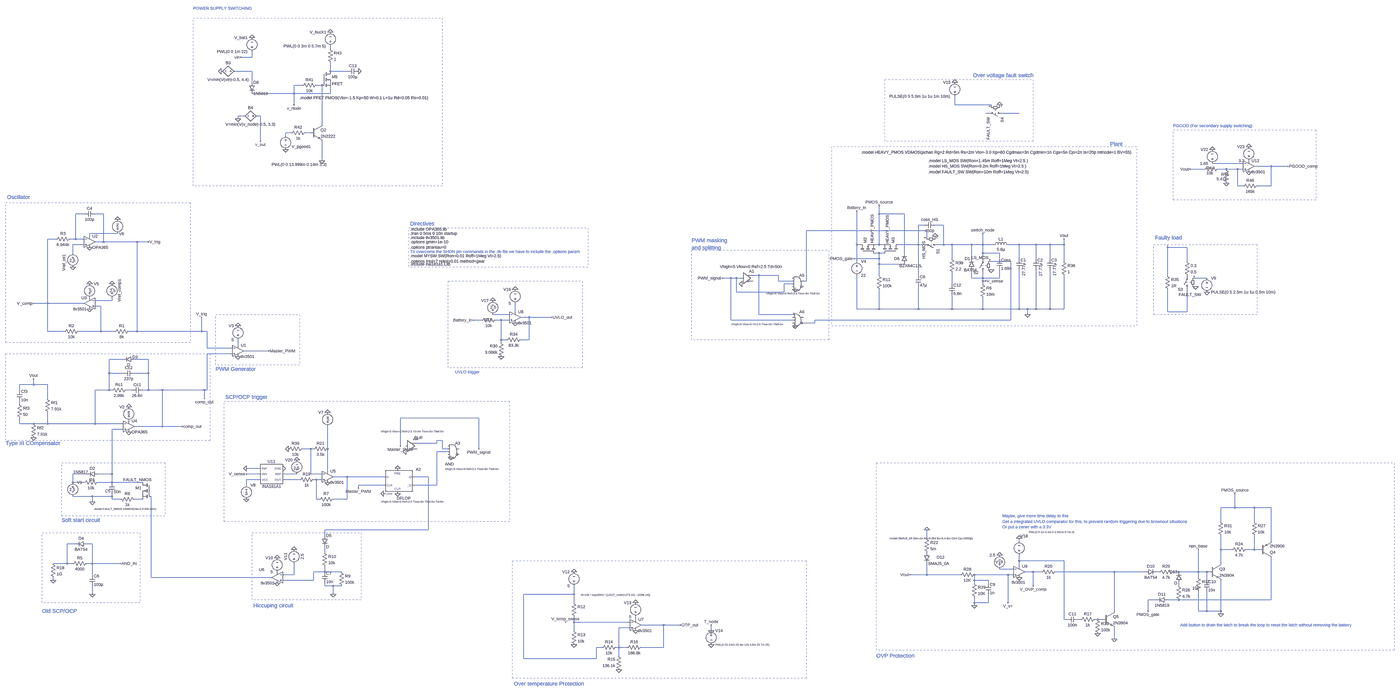
[diagram p0: schematic behavioural_model_complete.asc, whole sheet]
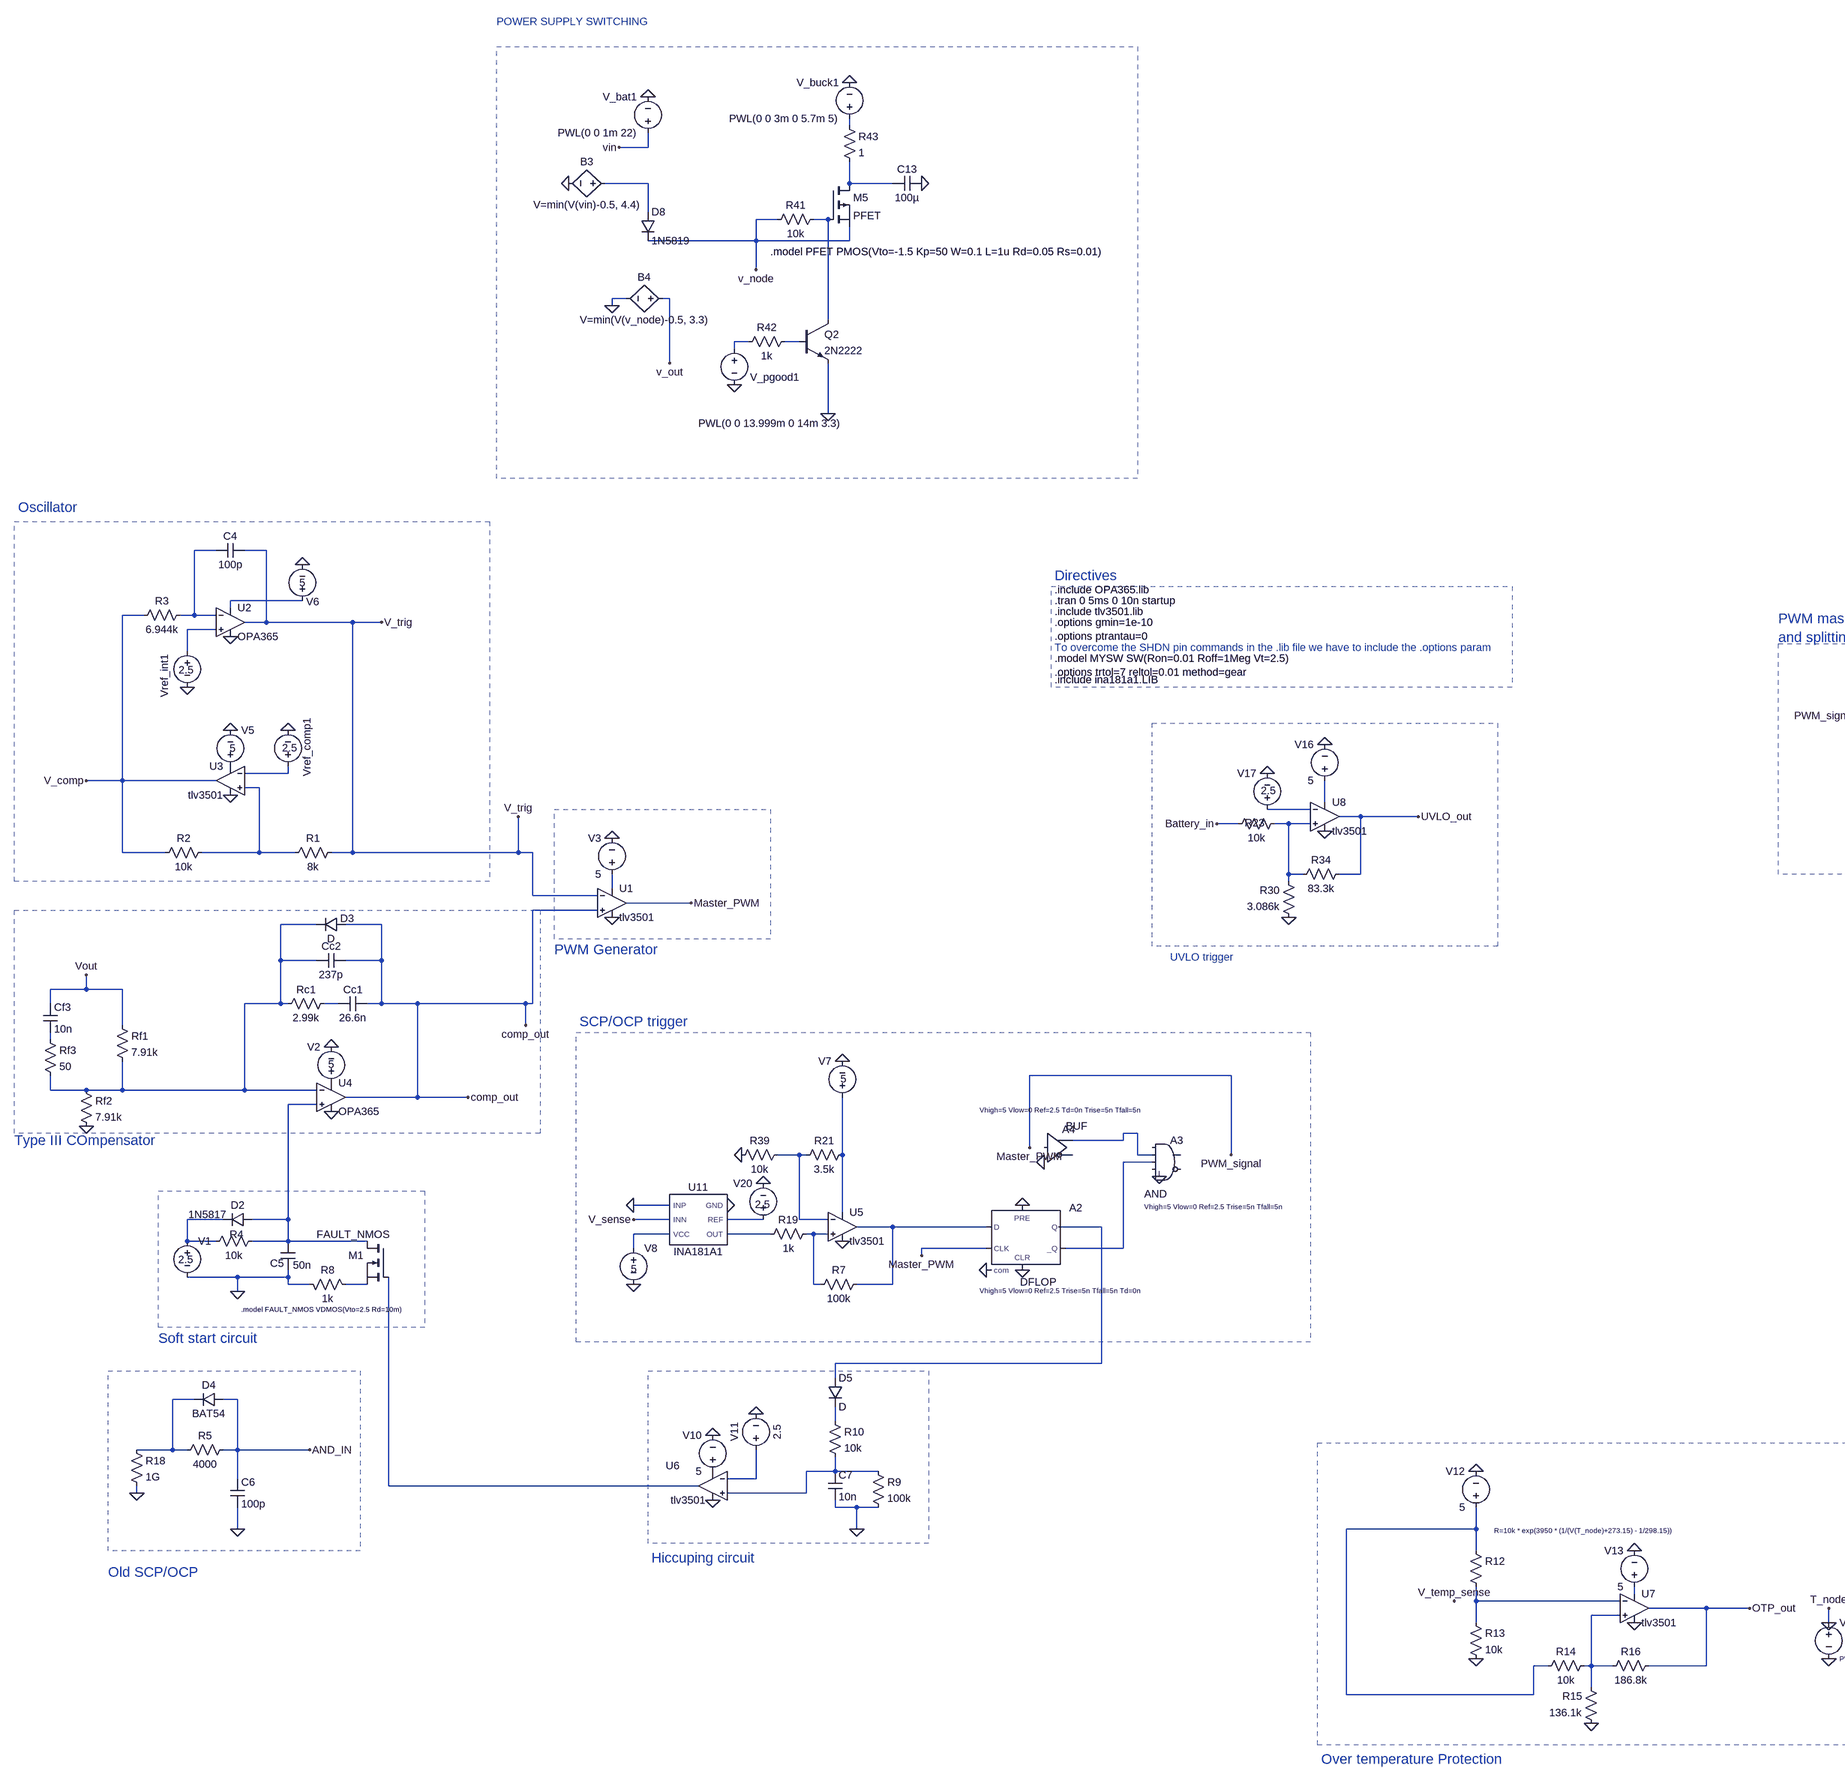
[diagram p1: schematic behavioural_model_complete.asc, part, row 1 of 1, column 1 of 2]
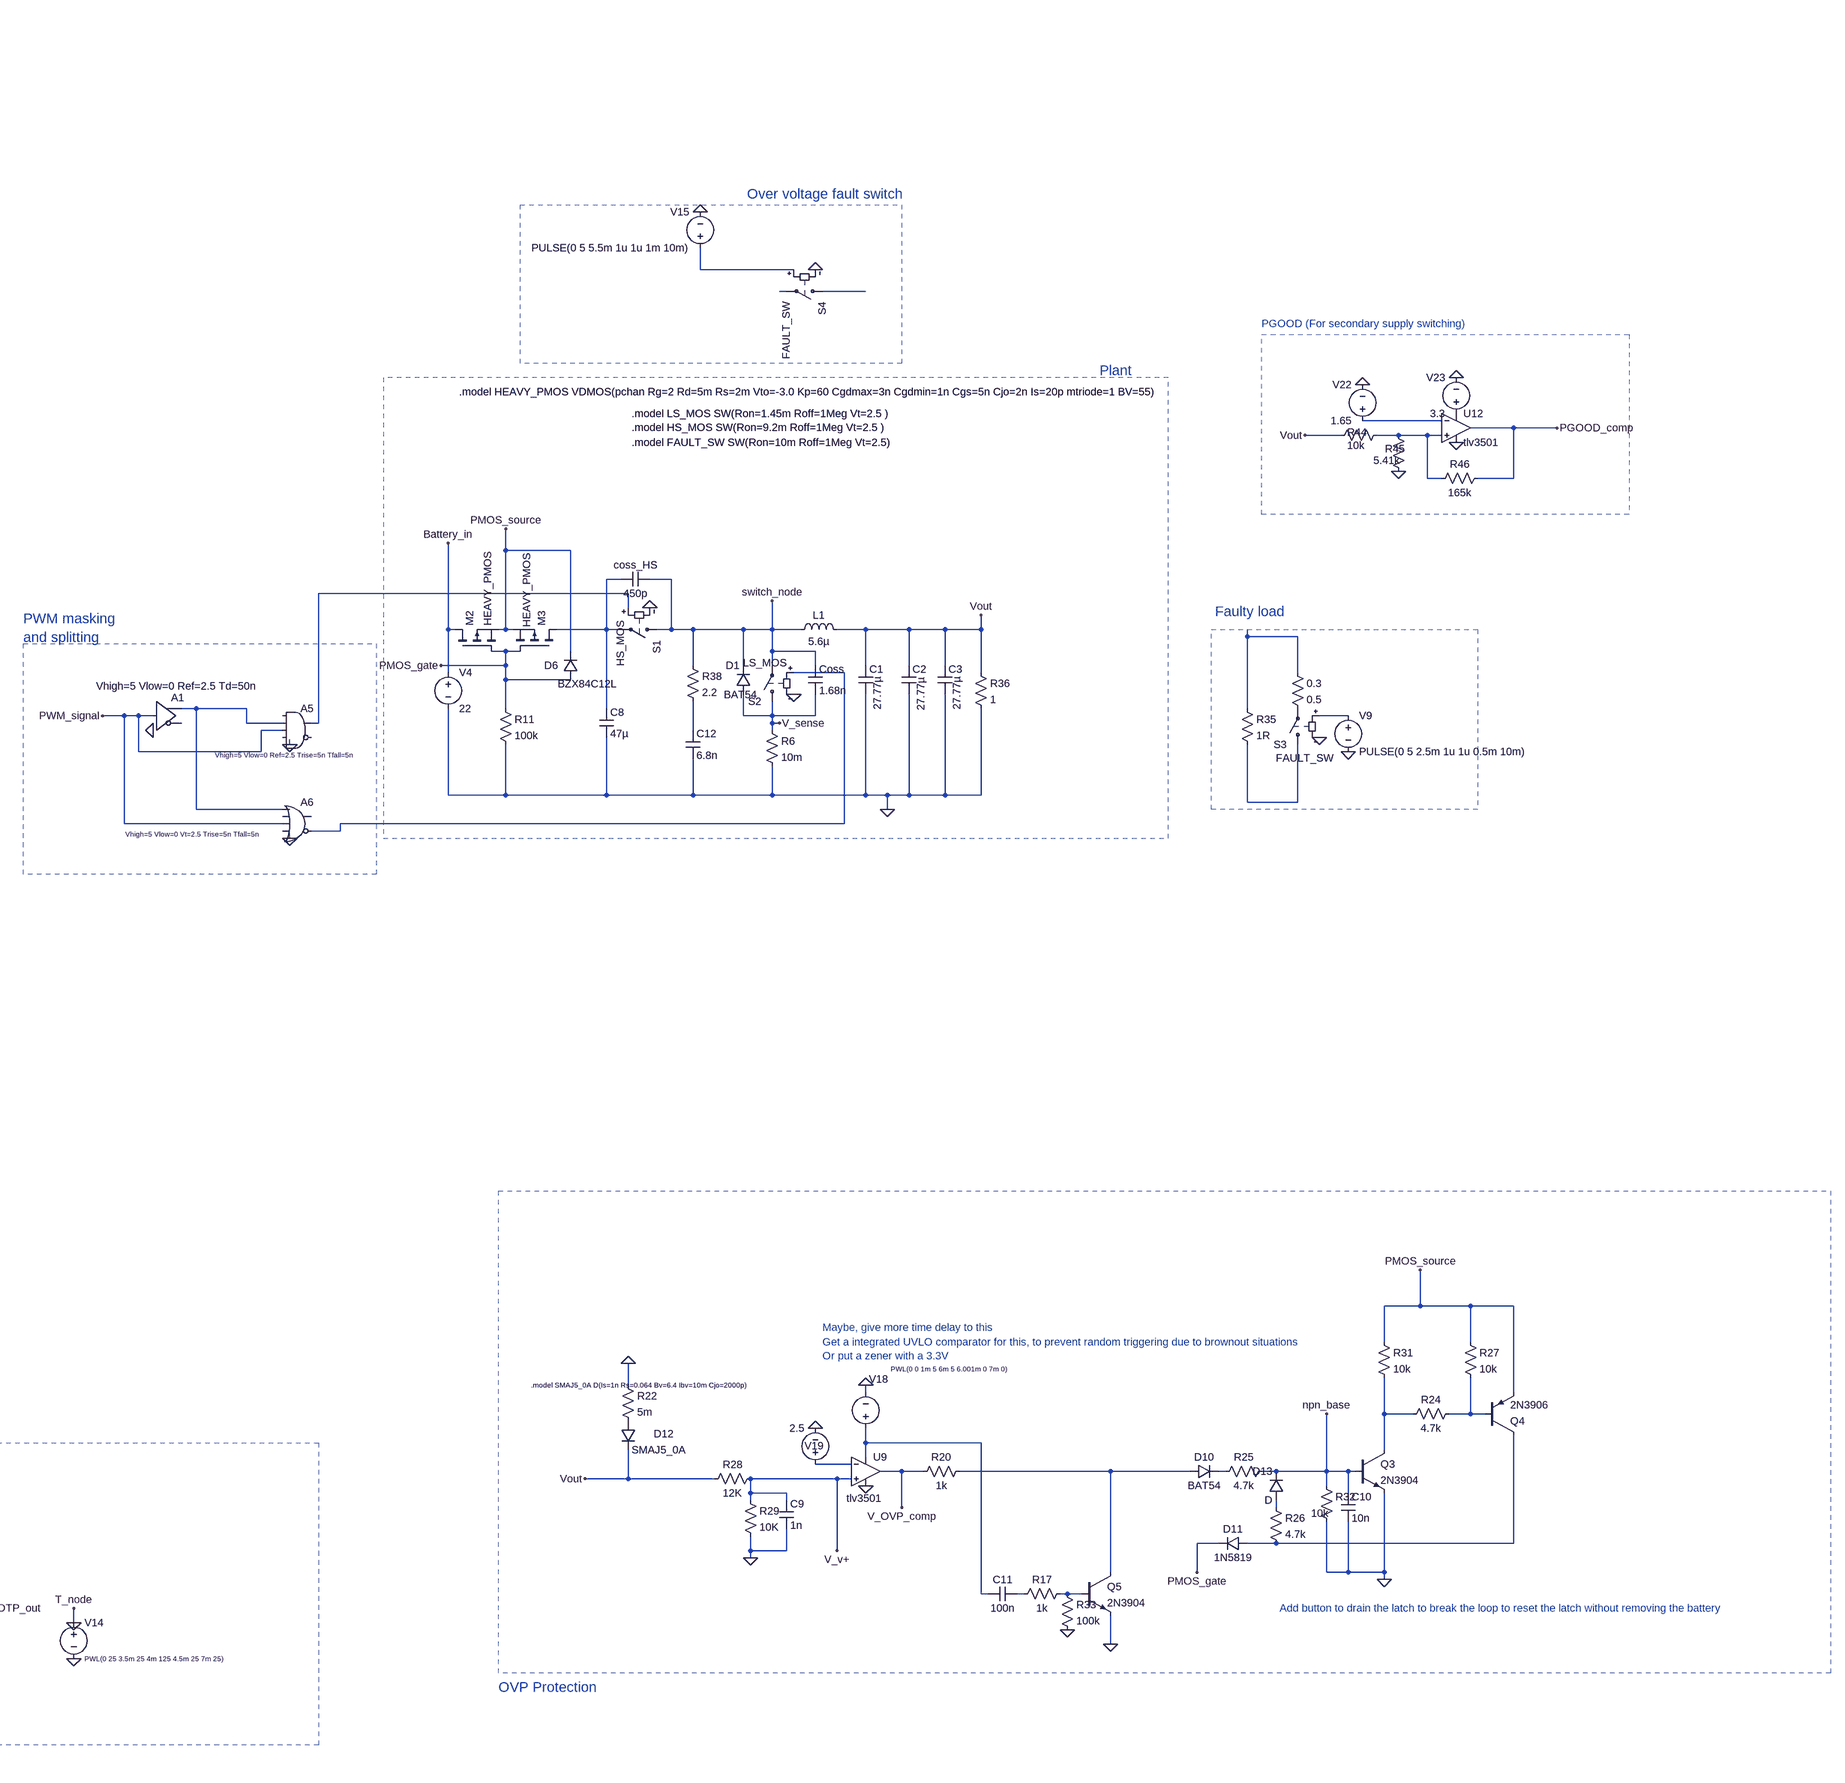
[diagram p2: schematic behavioural_model_complete.asc, part, row 1 of 1, column 2 of 2]
behavioural_model_complete.asc, the LTspice schematic file:
Version 4.1
SHEET 1 6772 2808
WIRE 688 -1504 688 -1520
WIRE 240 -1456 240 -1488
WIRE 240 -1456 176 -1456
WIRE 240 -1376 144 -1376
WIRE 688 -1376 688 -1424
WIRE 784 -1376 688 -1376
WIRE 240 -1312 240 -1376
WIRE 528 -1296 480 -1296
WIRE 640 -1296 608 -1296
WIRE 480 -1248 480 -1296
WIRE 480 -1248 240 -1248
WIRE 688 -1248 688 -1280
WIRE 688 -1248 480 -1248
WIRE 480 -1184 480 -1248
WIRE 4256 -1184 4256 -1232
WIRE 4464 -1184 4256 -1184
WIRE 4448 -1136 4432 -1136
WIRE 4624 -1136 4528 -1136
WIRE 192 -1120 160 -1120
WIRE 288 -1120 272 -1120
WIRE 160 -1104 160 -1120
WIRE 640 -1072 640 -1296
WIRE 464 -1024 432 -1024
WIRE 576 -1024 544 -1024
WIRE 432 -1008 432 -1024
WIRE 288 -976 288 -1120
WIRE 640 -864 640 -976
WIRE 5904 -848 5728 -848
WIRE 6064 -832 5968 -832
WIRE 6160 -832 6064 -832
WIRE 5680 -816 5600 -816
WIRE 5808 -816 5760 -816
WIRE 5872 -816 5808 -816
WIRE 5904 -816 5872 -816
WIRE 5872 -720 5872 -816
WIRE 5904 -720 5872 -720
WIRE 6064 -720 6064 -832
WIRE 6064 -720 5984 -720
WIRE -720 -560 -768 -560
WIRE -608 -560 -656 -560
WIRE 3824 -560 3824 -608
WIRE 3968 -560 3824 -560
WIRE 4080 -496 4048 -496
WIRE 4192 -496 4144 -496
WIRE 4096 -464 3408 -464
WIRE -528 -448 -688 -448
WIRE -688 -432 -688 -448
WIRE 4096 -432 4096 -464
WIRE -880 -416 -928 -416
WIRE -768 -416 -768 -560
WIRE -768 -416 -800 -416
WIRE -720 -416 -768 -416
WIRE -608 -400 -608 -560
WIRE -608 -400 -656 -400
WIRE -416 -400 -608 -400
WIRE -352 -400 -416 -400
WIRE -720 -384 -784 -384
WIRE 3696 -384 3696 -576
WIRE 3712 -384 3696 -384
WIRE 3824 -384 3824 -560
WIRE 3824 -384 3808 -384
WIRE 3840 -384 3824 -384
WIRE 4048 -384 4048 -496
WIRE 4048 -384 3936 -384
WIRE 4080 -384 4048 -384
WIRE 4192 -384 4192 -496
WIRE 4192 -384 4160 -384
WIRE 4240 -384 4192 -384
WIRE 4352 -384 4240 -384
WIRE 4416 -384 4416 -448
WIRE 4416 -384 4352 -384
WIRE 4480 -384 4416 -384
WIRE 4624 -384 4560 -384
WIRE 4720 -384 4624 -384
WIRE 4800 -384 4720 -384
WIRE 4880 -384 4880 -416
WIRE 4880 -384 4800 -384
WIRE 5472 -368 5472 -384
WIRE 5584 -368 5472 -368
WIRE -784 -336 -784 -384
WIRE 3824 -336 3792 -336
WIRE 3856 -336 3824 -336
WIRE 3968 -336 3968 -560
WIRE 4416 -336 4416 -384
WIRE 4512 -336 4416 -336
WIRE 3824 -304 3824 -336
WIRE 3824 -304 3680 -304
WIRE 4240 -304 4240 -384
WIRE 4352 -304 4352 -384
WIRE 4416 -304 4416 -336
WIRE 4512 -304 4512 -336
WIRE 4624 -304 4624 -384
WIRE 4720 -304 4720 -384
WIRE 4800 -304 4800 -384
WIRE 3696 -288 3696 -384
WIRE 4576 -288 4464 -288
WIRE 4880 -288 4880 -384
WIRE 5584 -288 5584 -368
WIRE 3824 -272 3824 -304
WIRE 3968 -272 3824 -272
WIRE 3136 -208 3104 -208
WIRE 3248 -208 3136 -208
WIRE 3824 -208 3824 -272
WIRE 4048 -208 4048 -384
WIRE 5472 -208 5472 -368
WIRE 2976 -192 2928 -192
WIRE 3008 -192 2976 -192
WIRE 3040 -192 3008 -192
WIRE 4352 -192 4352 -240
WIRE 4416 -192 4416 -224
WIRE 4416 -192 4352 -192
WIRE 4512 -192 4512 -240
WIRE 4512 -192 4416 -192
WIRE 5696 -192 5632 -192
WIRE 3248 -176 3248 -208
WIRE 3328 -176 3248 -176
WIRE 3408 -176 3408 -464
WIRE 3408 -176 3392 -176
WIRE 4416 -176 4416 -192
WIRE 4432 -176 4416 -176
WIRE 3328 -160 3280 -160
WIRE 4240 -160 4240 -224
WIRE 4416 -160 4416 -176
WIRE 3008 -112 3008 -192
WIRE 3280 -112 3280 -160
WIRE 3280 -112 3008 -112
WIRE -560 -64 -560 -80
WIRE -560 -64 -656 -64
WIRE -928 -48 -928 -416
WIRE -928 -48 -1008 -48
WIRE -720 -48 -928 -48
WIRE -624 -32 -656 -32
WIRE 3696 -16 3696 -208
WIRE 3824 -16 3824 -128
WIRE 3824 -16 3696 -16
WIRE 4048 -16 4048 -144
WIRE 4048 -16 3824 -16
WIRE 4240 -16 4240 -96
WIRE 4240 -16 4048 -16
WIRE 4416 -16 4416 -80
WIRE 4416 -16 4240 -16
WIRE 4624 -16 4624 -240
WIRE 4624 -16 4416 -16
WIRE 4672 -16 4624 -16
WIRE 4720 -16 4720 -240
WIRE 4720 -16 4672 -16
WIRE 4800 -16 4800 -240
WIRE 4800 -16 4720 -16
WIRE 4880 -16 4880 -208
WIRE 4880 -16 4800 -16
WIRE 1744 0 1744 -48
WIRE 5472 0 5472 -128
WIRE 5584 0 5584 -128
WIRE 5584 0 5472 0
WIRE 1712 16 1616 16
WIRE 3136 16 3136 -208
WIRE 3328 16 3136 16
WIRE 4672 16 4672 -16
WIRE 1824 32 1776 32
WIRE 1952 32 1824 32
WIRE 1552 48 1504 48
WIRE 1664 48 1632 48
WIRE 1712 48 1664 48
WIRE 2976 48 2976 -192
WIRE 3328 48 2976 48
WIRE 4576 48 4576 -288
WIRE 4576 48 3456 48
WIRE 3456 64 3456 48
WIRE 3456 64 3392 64
WIRE -928 112 -928 -48
WIRE -832 112 -928 112
WIRE -624 112 -624 -32
WIRE -624 112 -752 112
WIRE -544 112 -624 112
WIRE -416 112 -416 -400
WIRE -416 112 -464 112
WIRE -48 112 -48 32
WIRE -48 112 -416 112
WIRE -16 112 -48 112
WIRE 1664 160 1664 48
WIRE 1696 160 1664 160
WIRE 1824 160 1824 32
WIRE 1824 160 1776 160
WIRE 1664 176 1664 160
WIRE 160 192 160 160
WIRE -16 208 -16 112
WIRE 128 208 -16 208
WIRE 336 224 192 224
WIRE 128 240 -16 240
WIRE -496 272 -576 272
WIRE -352 272 -432 272
WIRE -576 352 -576 272
WIRE -496 352 -576 352
WIRE -352 352 -352 272
WIRE -352 352 -432 352
WIRE -1008 416 -1008 384
WIRE -1008 416 -1088 416
WIRE -928 416 -1008 416
WIRE -1088 448 -1088 416
WIRE -576 448 -576 352
WIRE -576 448 -656 448
WIRE -560 448 -576 448
WIRE -448 448 -480 448
WIRE -352 448 -352 352
WIRE -352 448 -384 448
WIRE -272 448 -352 448
WIRE -32 448 -272 448
WIRE -16 448 -16 240
WIRE -16 448 -32 448
WIRE -928 496 -928 416
WIRE -32 496 -32 448
WIRE -1088 528 -1088 512
WIRE 1536 608 1088 608
WIRE -1088 640 -1088 608
WIRE -1008 640 -1088 640
WIRE -928 640 -928 576
WIRE -928 640 -1008 640
WIRE -656 640 -656 448
WIRE -656 640 -928 640
WIRE -496 640 -656 640
WIRE -272 656 -272 448
WIRE -272 656 -432 656
WIRE -160 656 -272 656
WIRE -496 672 -560 672
WIRE 1328 736 1296 736
WIRE 1296 752 1296 736
WIRE 1296 752 1184 752
WIRE 1088 768 1088 608
WIRE 576 784 528 784
WIRE 592 784 576 784
WIRE 672 784 672 656
WIRE 1328 784 1328 736
WIRE 1360 784 1328 784
WIRE 1536 784 1536 608
WIRE 1360 800 1296 800
WIRE 288 896 208 896
WIRE 672 912 672 784
WIRE -704 928 -784 928
WIRE -560 928 -560 672
WIRE -560 928 -640 928
WIRE 288 928 208 928
WIRE 496 928 416 928
WIRE 576 928 576 784
WIRE 640 928 576 928
WIRE 784 944 704 944
WIRE 992 944 784 944
WIRE 1248 944 1152 944
WIRE 288 960 208 960
WIRE 512 960 416 960
WIRE 608 960 592 960
WIRE 640 960 608 960
WIRE -784 976 -784 928
WIRE -720 976 -784 976
WIRE -560 976 -560 928
WIRE -560 976 -640 976
WIRE -384 976 -560 976
WIRE 208 992 208 960
WIRE 992 992 848 992
WIRE 1296 992 1296 800
WIRE 1296 992 1168 992
WIRE 848 1008 848 992
WIRE -672 1056 -784 1056
WIRE -560 1056 -560 1040
WIRE -560 1056 -672 1056
WIRE -560 1072 -560 1056
WIRE -512 1072 -560 1072
WIRE -384 1072 -432 1072
WIRE 608 1072 608 960
WIRE 624 1072 608 1072
WIRE 784 1072 784 944
WIRE 784 1072 704 1072
WIRE -672 1088 -672 1056
WIRE 5856 1120 5856 1040
WIRE 5856 1120 5776 1120
WIRE 5968 1120 5856 1120
WIRE 6064 1120 5968 1120
WIRE 5776 1200 5776 1120
WIRE 5968 1200 5968 1120
WIRE 1248 1248 1248 944
WIRE 1248 1248 656 1248
WIRE 656 1280 656 1248
WIRE 4096 1296 4096 1248
WIRE 4624 1312 4624 1296
WIRE 6064 1312 6064 1120
WIRE -768 1328 -816 1328
WIRE -672 1328 -704 1328
WIRE 5776 1360 5776 1280
WIRE 5840 1360 5776 1360
WIRE 5968 1360 5968 1280
WIRE 5968 1360 5920 1360
WIRE 6000 1360 5968 1360
WIRE 656 1376 656 1344
WIRE 4624 1424 4624 1392
WIRE 4880 1424 4624 1424
WIRE -816 1440 -816 1328
WIRE -816 1440 -896 1440
WIRE -784 1440 -816 1440
WIRE -672 1440 -672 1328
WIRE -672 1440 -704 1440
WIRE -512 1440 -672 1440
WIRE 5776 1440 5776 1360
WIRE 4624 1456 4624 1424
WIRE 4592 1472 4512 1472
WIRE 656 1488 656 1456
WIRE 656 1488 592 1488
WIRE 752 1488 656 1488
WIRE 4704 1488 4656 1488
WIRE 4752 1488 4704 1488
WIRE 5168 1488 4832 1488
WIRE 5344 1488 5168 1488
WIRE 5424 1488 5408 1488
WIRE 5536 1488 5504 1488
WIRE 5648 1488 5648 1360
WIRE 5648 1488 5536 1488
WIRE 5696 1488 5648 1488
WIRE 5712 1488 5696 1488
WIRE -672 1504 -672 1440
WIRE 480 1504 480 1440
WIRE 480 1504 416 1504
WIRE 4096 1504 4096 1440
WIRE 4096 1504 4000 1504
WIRE 4288 1504 4096 1504
WIRE 4560 1504 4368 1504
WIRE 4592 1504 4560 1504
WIRE -336 1520 -336 1056
WIRE 352 1520 -336 1520
WIRE 5648 1520 5648 1488
WIRE -896 1536 -896 1520
WIRE 592 1536 592 1488
WIRE 592 1536 416 1536
WIRE 4368 1536 4368 1504
WIRE 4448 1536 4368 1536
WIRE 5696 1536 5696 1488
WIRE 4368 1552 4368 1536
WIRE 4448 1552 4448 1536
WIRE 656 1568 656 1552
WIRE 704 1568 656 1568
WIRE 752 1568 704 1568
WIRE 4704 1568 4704 1488
WIRE 5536 1568 5536 1552
WIRE -672 1616 -672 1568
WIRE 704 1616 704 1568
WIRE 2080 1616 2080 1568
WIRE 2080 1616 1792 1616
WIRE 5408 1648 5360 1648
WIRE 5536 1648 5472 1648
WIRE 6064 1648 6064 1408
WIRE 6064 1648 5536 1648
WIRE 2080 1664 2080 1616
WIRE 4368 1664 4368 1632
WIRE 4448 1664 4448 1616
WIRE 4448 1664 4368 1664
WIRE 4560 1664 4560 1504
WIRE 4368 1680 4368 1664
WIRE 5168 1712 5168 1488
WIRE 5360 1712 5360 1648
WIRE 5648 1712 5648 1600
WIRE 5696 1712 5696 1600
WIRE 5696 1712 5648 1712
WIRE 5776 1712 5776 1536
WIRE 5776 1712 5696 1712
WIRE 5776 1728 5776 1712
WIRE 2432 1760 2432 1744
WIRE 4880 1760 4880 1424
WIRE 4896 1760 4880 1760
WIRE 4976 1760 4960 1760
WIRE 5072 1760 5056 1760
WIRE 5104 1760 5072 1760
WIRE 2080 1776 2080 1744
WIRE 2400 1776 2080 1776
WIRE 2592 1792 2464 1792
WIRE 2688 1792 2592 1792
WIRE 2400 1808 2336 1808
WIRE 2080 1824 2080 1776
WIRE 2864 1824 2864 1792
WIRE 5168 1872 5168 1808
WIRE 2240 1920 2208 1920
WIRE 2336 1920 2336 1808
WIRE 2336 1920 2320 1920
WIRE 2384 1920 2336 1920
WIRE 2592 1920 2592 1792
WIRE 2592 1920 2464 1920
WIRE 2336 1968 2336 1920
WIRE 1792 1984 1792 1616
WIRE 2208 1984 2208 1920
WIRE 2208 1984 1792 1984
FLAG 4672 16 0
FLAG -1008 720 0
FLAG -464 544 0
FLAG -464 688 0
FLAG -160 656 comp_out
FLAG 4880 -416 Vout
FLAG 160 256 0
FLAG -32 496 comp_out
FLAG 160 80 0
FLAG 4144 -432 0
FLAG -688 -160 0
FLAG -528 -528 0
FLAG -688 -16 0
FLAG -560 -160 0
FLAG -784 -256 0
FLAG -352 -400 V_trig
FLAG -1008 -48 V_comp
FLAG -688 -368 0
FLAG -48 32 V_trig
FLAG -1008 384 Vout
FLAG -672 1088 0
FLAG 4464 -240 0
FLAG -672 1616 0
FLAG -512 1440 AND_IN
FLAG 4432 -176 V_sense
FLAG 208 928 V_sense
FLAG 336 224 Master_PWM
FLAG 1088 768 Master_PWM
FLAG 848 1008 Master_PWM
FLAG 1536 784 PWM_signal
FLAG 672 576 0
FLAG 672 976 0
FLAG 1072 896 0
FLAG 1072 1040 0
FLAG 992 1040 0
FLAG 1376 832 0
FLAG 5632 -144 0
FLAG 5696 -112 0
FLAG 704 1616 0
FLAG 384 1408 0
FLAG 384 1552 0
FLAG 480 1360 0
FLAG 1120 800 0
FLAG 3040 -160 0
FLAG 3344 -128 0
FLAG 3344 80 0
FLAG 2928 -192 PWM_signal
FLAG 2080 1488 0
FLAG 2080 1904 0
FLAG 2032 1776 V_temp_sense
FLAG 2432 1664 0
FLAG 2432 1824 0
FLAG 2336 2048 0
FLAG 2864 1904 0
FLAG 2864 1792 T_node
FLAG 3680 -304 PMOS_gate
FLAG 3824 -608 PMOS_source
FLAG 4624 1296 0
FLAG 4624 1520 0
FLAG 5776 1728 0
FLAG 4512 1392 0
FLAG 4560 1664 V_v+
FLAG 4704 1568 V_OVP_comp
FLAG 4368 1680 0
FLAG 5168 1872 0
FLAG 5072 1840 0
FLAG 5648 1360 npn_base
FLAG 4000 1504 Vout
FLAG 5856 1040 PMOS_source
FLAG 5360 1712 PMOS_gate
FLAG -896 1536 0
FLAG 4256 -1312 0
FLAG 4512 -1184 0
FLAG 4096 1248 0
FLAG 3696 -576 Battery_in
FLAG 1744 -128 0
FLAG 1744 64 0
FLAG 1664 256 0
FLAG 1504 48 Battery_in
FLAG 1616 -64 0
FLAG 2688 1792 OTP_out
FLAG 1952 32 UVLO_out
FLAG 2864 1824 0
FLAG 4416 -448 switch_node
FLAG 208 896 0
FLAG 208 1072 0
FLAG 416 896 0
FLAG 496 848 0
FLAG 448 784 0
FLAG 5728 -928 0
FLAG 5936 -800 0
FLAG 5600 -816 Vout
FLAG 5808 -736 0
FLAG 5936 -944 0
FLAG 6160 -832 PGOOD_comp
FLAG 176 -1456 vin
FLAG 240 -1568 0
FLAG 64 -1376 0
FLAG 432 -928 0
FLAG 688 -1600 0
FLAG 640 -864 0
FLAG 480 -1184 v_node
FLAG 160 -1104 0
FLAG 288 -976 v_out
FLAG 848 -1376 0
SYMBOL cap 4608 -304 R0
WINDOW 3 42 24 VRight 2
SYMATTR Value 27.77µ
SYMATTR InstName C1
SYMATTR SpiceLine V=25 Rser=2.94m Lser=0.6n
SYMBOL ind 4464 -368 R270
WINDOW 0 32 56 VTop 2
WINDOW 3 5 56 VBottom 2
SYMATTR InstName L1
SYMATTR Value 5.6µ
SYMATTR SpiceLine Rser=1m
SYMBOL voltage -784 960 R0
WINDOW 123 0 0 Left 0
WINDOW 39 0 0 Left 0
WINDOW 3 -20 57 Left 2
SYMATTR Value 2.5
SYMATTR InstName V1
SYMBOL res -944 480 R0
SYMATTR InstName Rf1
SYMATTR Value 7.91k
SYMBOL res -1104 512 R0
SYMATTR InstName Rf3
SYMATTR Value 50
SYMBOL cap -1104 448 R0
SYMATTR InstName Cf3
SYMATTR Value 10n
SYMBOL res -464 432 R90
WINDOW 0 0 56 VBottom 2
WINDOW 3 32 56 VTop 2
SYMATTR InstName Rc1
SYMATTR Value 2.99k
SYMBOL cap -432 336 R90
WINDOW 0 0 32 VBottom 2
WINDOW 3 32 32 VTop 2
SYMATTR InstName Cc2
SYMATTR Value 237p
SYMBOL res -1024 624 R0
SYMATTR InstName Rf2
SYMATTR Value 7.91k
SYMBOL voltage -464 640 R180
WINDOW 0 24 96 Left 2
WINDOW 3 -7 57 Left 2
WINDOW 123 0 0 Left 0
WINDOW 39 0 0 Left 0
SYMATTR InstName V2
SYMATTR Value 5
SYMBOL cap -384 432 R90
WINDOW 0 0 32 VBottom 2
WINDOW 3 32 32 VTop 2
SYMATTR InstName Cc1
SYMATTR Value 26.6n
SYMBOL cap 4704 -304 R0
WINDOW 3 43 26 VRight 2
SYMATTR Value 27.77µ
SYMATTR InstName C2
SYMATTR SpiceLine V=25 Rser=2.94m Lser=0.6n
SYMBOL cap 4784 -304 R0
WINDOW 3 43 24 VRight 2
SYMATTR Value 27.77µ
SYMATTR InstName C3
SYMATTR SpiceLine V=25 Rser=2.94m Lser=0.6n
SYMBOL OpAmps\\opamp2 160 160 R0
SYMATTR InstName U1
SYMATTR Value tlv3501
SYMBOL voltage 160 176 R180
WINDOW 0 24 96 Left 2
WINDOW 3 24 16 Left 2
WINDOW 123 0 0 Left 0
WINDOW 39 0 0 Left 0
SYMATTR InstName V3
SYMATTR Value 5
SYMBOL sw 4176 -384 R90
WINDOW 3 -19 97 Left 2
SYMATTR Value HS_MOS
SYMATTR InstName S1
SYMBOL voltage 3696 -304 R0
SYMATTR InstName V4
SYMATTR Value 22
SYMBOL voltage -688 -64 M180
WINDOW 0 24 96 Left 2
WINDOW 3 -2 56 Left 2
WINDOW 123 0 0 Left 0
WINDOW 39 0 0 Left 0
SYMATTR InstName V5
SYMATTR Value 5
SYMBOL voltage -528 -432 R180
WINDOW 0 -38 14 Left 2
WINDOW 3 -7 56 Left 2
WINDOW 123 0 0 Left 0
WINDOW 39 0 0 Left 0
SYMATTR InstName V6
SYMATTR Value 5
SYMBOL res -448 96 R90
WINDOW 0 0 56 VBottom 2
WINDOW 3 32 56 VTop 2
SYMATTR InstName R1
SYMATTR Value 8k
SYMBOL res -736 96 R90
WINDOW 0 0 56 VBottom 2
WINDOW 3 32 56 VTop 2
SYMATTR InstName R2
SYMATTR Value 10k
SYMBOL res -784 -432 R90
WINDOW 0 0 56 VBottom 2
WINDOW 3 32 56 VTop 2
SYMATTR InstName R3
SYMATTR Value 6.944k
SYMBOL cap -656 -576 R90
WINDOW 0 0 32 VBottom 2
WINDOW 3 32 32 VTop 2
SYMATTR InstName C4
SYMATTR Value 100p
SYMBOL voltage -560 -64 R180
WINDOW 0 -43 -7 VRight 2
WINDOW 3 -21 57 Left 2
WINDOW 123 0 0 Left 0
WINDOW 39 0 0 Left 0
SYMATTR InstName Vref_comp1
SYMATTR Value 2.5
SYMBOL voltage -784 -352 R0
WINDOW 0 -50 22 VRight 2
WINDOW 3 -19 58 Left 2
WINDOW 123 0 0 Left 0
WINDOW 39 0 0 Left 0
SYMATTR InstName Vref_int1
SYMATTR Value 2.5
SYMBOL OpAmps\\opamp2 -688 -464 R0
SYMATTR InstName U2
SYMATTR Value OPA365
SYMBOL OpAmps\\opamp2 -688 -112 M0
SYMATTR InstName U3
SYMATTR Value tlv3501
SYMBOL OpAmps\\opamp2 -464 592 R0
SYMATTR InstName U4
SYMATTR Value OPA365
SYMBOL res -624 960 R90
WINDOW 0 17 50 VBottom 2
WINDOW 3 32 56 VTop 2
SYMATTR InstName R4
SYMATTR Value 10k
SYMBOL cap -576 976 R0
WINDOW 0 -24 49 Left 2
WINDOW 3 27 53 Left 2
SYMATTR InstName C5
SYMATTR Value 50n
SYMBOL diode -640 912 R90
WINDOW 0 0 32 VBottom 2
WINDOW 3 -11 99 VTop 2
SYMATTR InstName D2
SYMATTR Value 1N5817
SYMBOL sw 4416 -208 R180
WINDOW 3 -33 102 Left 2
SYMATTR Value LS_MOS
SYMATTR InstName S2
SYMBOL diode 4368 -240 R180
WINDOW 0 24 64 Left 2
WINDOW 3 -14 -1 Left 2
SYMATTR InstName D1
SYMATTR Value BAT54
SYMBOL diode -432 256 R90
WINDOW 0 18 -4 VBottom 2
WINDOW 3 32 32 VTop 2
SYMATTR InstName D3
SYMBOL res -688 1424 R90
WINDOW 0 0 56 VBottom 2
WINDOW 3 32 56 VTop 2
SYMATTR InstName R5
SYMATTR Value 4000
SYMBOL cap -688 1504 R0
SYMATTR InstName C6
SYMATTR Value 100p
SYMBOL diode -704 1312 R90
WINDOW 0 0 32 VBottom 2
WINDOW 3 32 32 VTop 2
SYMATTR InstName D4
SYMATTR Value BAT54
SYMBOL res 4400 -176 R0
SYMATTR InstName R6
SYMATTR Value 10m
SYMBOL OpAmps\\opamp2 672 880 R0
SYMATTR InstName U5
SYMATTR Value tlv3501
SYMBOL Digital\\dflop 1072 896 R0
WINDOW 3 -5 171 Left 2
WINDOW 123 -95 190 Left 1
SYMATTR Value DFLOP
SYMATTR Value2 Vhigh=5 Vlow=0 Ref=2.5 Trise=5n Tfall=5n Td=0n
SYMATTR InstName A2
SYMATTR SpiceModel ""
SYMBOL Digital\\and 1392 736 R0
WINDOW 3 -49 135 Left 2
WINDOW 123 -49 163 Left 1
SYMATTR Value AND
SYMATTR Value2 Vhigh=5 Vlow=0 Ref=2.5 Trise=5n Tfall=5n
SYMATTR InstName A3
SYMATTR SpiceModel ""
SYMBOL voltage 672 672 R180
WINDOW 0 24 96 Left 2
WINDOW 3 -9 57 Left 2
WINDOW 123 0 0 Left 0
WINDOW 39 0 0 Left 0
SYMATTR InstName V7
SYMATTR Value 5
SYMBOL sw 5584 -112 R180
WINDOW 3 -80 -14 Left 2
SYMATTR Value FAULT_SW
SYMATTR InstName S3
SYMBOL res 5568 -304 R0
SYMATTR InstName 0.3
SYMATTR Value 0.5
SYMBOL voltage 5696 -208 R0
WINDOW 123 0 0 Left 0
WINDOW 39 0 0 Left 0
SYMATTR Value PULSE(0 5 2.5m 1u 1u 0.5m 10m)
SYMATTR InstName V9
SYMBOL nmos -336 976 M0
WINDOW 3 -2 -15 Left 2
SYMATTR Value FAULT_NMOS
SYMATTR InstName M1
SYMBOL res -416 1088 M270
WINDOW 0 32 56 VTop 2
WINDOW 3 0 56 VBottom 2
SYMATTR InstName R8
SYMATTR Value 1k
SYMBOL cap 640 1488 R0
SYMATTR InstName C7
SYMATTR Value 10n
SYMBOL res 736 1472 R0
SYMATTR InstName R9
SYMATTR Value 100k
SYMBOL diode 640 1280 R0
SYMATTR InstName D5
SYMBOL res 640 1360 R0
SYMATTR InstName R10
SYMATTR Value 10k
SYMBOL OpAmps\\opamp2 384 1456 M0
WINDOW 0 74 19 Left 2
SYMATTR InstName U6
SYMATTR Value tlv3501
SYMBOL voltage 384 1504 R180
WINDOW 0 24 96 Left 2
WINDOW 3 24 16 Left 2
WINDOW 123 0 0 Left 0
WINDOW 39 0 0 Left 0
SYMATTR InstName V10
SYMATTR Value 5
SYMBOL voltage 480 1456 M180
WINDOW 0 -32 56 VBottom 2
WINDOW 3 32 56 VTop 2
WINDOW 123 0 0 Left 0
WINDOW 39 0 0 Left 0
SYMATTR InstName V11
SYMATTR Value 2.5
SYMBOL Digital\\buf 1120 704 R0
WINDOW 3 49 16 Left 2
WINDOW 123 -143 -20 Left 1
SYMATTR Value BUF
SYMATTR Value2 Vhigh=5 Vlow=0 Ref=2.5 Td=0n Trise=5n Tfall=5n
SYMATTR InstName A4
SYMATTR SpiceModel ""
SYMBOL Digital\\buf 3040 -256 R0
WINDOW 3 -126 -2 Left 2
SYMATTR Value Vhigh=5 Vlow=0 Ref=2.5 Td=50n
SYMATTR InstName A1
SYMBOL Digital\\and 3360 -224 R0
WINDOW 3 -182 119 Left 1
SYMATTR Value Vhigh=5 Vlow=0 Ref=2.5 Trise=5n Tfall=5n
SYMATTR InstName A5
SYMBOL Digital\\or 3360 -16 R0
WINDOW 3 -381 87 Left 1
SYMATTR Value Vhigh=5 Vlow=0 Vt=2.5 Trise=5n Tfall=5n
SYMATTR InstName A6
SYMBOL pmos 3712 -336 R270
SYMATTR InstName M2
SYMATTR Value HEAVY_PMOS
SYMBOL res 3808 -224 R0
SYMATTR InstName R11
SYMATTR Value 100k
SYMBOL diode 3984 -272 R180
WINDOW 0 44 32 Left 2
WINDOW 3 -87 -9 Left 2
SYMATTR InstName D6
SYMATTR Value BZX84C12L
SYMBOL res 2064 1648 R0
WINDOW 3 56 -29 Left 1
SYMATTR Value R=10k * exp(3950 * (1/(V(T_node)+273.15) - 1/298.15))
SYMATTR InstName R12
SYMBOL res 2064 1808 R0
SYMATTR InstName R13
SYMATTR Value 10k
SYMBOL voltage 2080 1584 R180
WINDOW 0 24 96 Left 2
WINDOW 3 24 16 Left 2
WINDOW 123 0 0 Left 0
WINDOW 39 0 0 Left 0
SYMATTR InstName V12
SYMATTR Value 5
SYMBOL OpAmps\\opamp2 2432 1728 R0
SYMATTR InstName U7
SYMATTR Value tlv3501
SYMBOL voltage 2432 1760 R180
WINDOW 0 24 96 Left 2
WINDOW 3 24 16 Left 2
WINDOW 123 0 0 Left 0
WINDOW 39 0 0 Left 0
SYMATTR InstName V13
SYMATTR Value 5
SYMBOL res 2336 1904 R90
WINDOW 0 0 56 VBottom 2
WINDOW 3 32 56 VTop 2
SYMATTR InstName R14
SYMATTR Value 10k
SYMBOL res 2352 2064 R180
WINDOW 0 36 76 Left 2
WINDOW 3 36 40 Left 2
SYMATTR InstName R15
SYMATTR Value 136.1k
SYMBOL res 2480 1904 R90
WINDOW 0 0 56 VBottom 2
WINDOW 3 32 56 VTop 2
SYMATTR InstName R16
SYMATTR Value 186.8k
SYMBOL voltage 2864 1808 R0
WINDOW 3 24 96 Left 1
SYMATTR Value PWL(0 25 3.5m 25 4m 125 4.5m 25 7m 25)
SYMATTR InstName V14
SYMBOL OpAmps\\opamp2 4624 1424 R0
WINDOW 3 -43 124 Left 2
SYMATTR Value tlv3501
SYMATTR InstName U9
SYMBOL voltage 4624 1408 R180
WINDOW 0 -50 125 Left 2
WINDOW 3 -317 148 Left 1
SYMATTR InstName V18
SYMATTR Value PWL(0 0 1m 5 6m 5 6.001m 0 7m 0)
SYMBOL voltage 4512 1488 R180
WINDOW 0 -19 57 Left 2
WINDOW 123 0 0 Left 0
WINDOW 39 0 0 Left 0
SYMATTR InstName V19
SYMATTR Value 2.5
SYMBOL npn 5712 1440 R0
SYMATTR InstName Q3
SYMATTR Value 2N3904
SYMBOL pnp 6000 1408 M180
SYMATTR InstName Q4
SYMATTR Value 2N3906
SYMBOL res 5936 1344 R90
WINDOW 0 0 56 VBottom 2
WINDOW 3 32 56 VTop 2
SYMATTR InstName R24
SYMATTR Value 4.7k
SYMBOL res 5520 1472 R90
WINDOW 0 0 56 VBottom 2
WINDOW 3 32 56 VTop 2
SYMATTR InstName R25
SYMATTR Value 4.7k
SYMBOL diode 5344 1504 R270
WINDOW 0 32 32 VTop 2
WINDOW 3 0 32 VBottom 2
SYMATTR InstName D10
SYMATTR Value BAT54
SYMBOL res 5520 1552 R0
SYMATTR InstName R26
SYMATTR Value 4.7k
SYMBOL diode 5472 1632 R90
WINDOW 0 0 32 VBottom 2
WINDOW 3 32 32 VTop 2
SYMATTR InstName D11
SYMATTR Value 1N5819
SYMBOL res 5952 1184 R0
SYMATTR InstName R27
SYMATTR Value 10k
SYMBOL diode 4080 1376 R0
WINDOW 0 73 28 Left 2
SYMATTR InstName D12
SYMATTR Value SMAJ5_0A
SYMBOL res 4384 1488 R90
WINDOW 0 0 56 VBottom 2
WINDOW 3 32 56 VTop 2
SYMATTR InstName R28
SYMATTR Value 12K
SYMBOL res 4352 1536 R0
SYMATTR InstName R29
SYMATTR Value 10K
SYMBOL cap 4432 1552 R0
SYMATTR InstName C9
SYMATTR Value 1n
SYMBOL cap 5680 1536 R0
SYMATTR InstName C10
SYMATTR Value 10n
SYMBOL res 5760 1184 R0
SYMATTR InstName R31
SYMATTR Value 10k
SYMBOL diode 5552 1552 R180
WINDOW 0 24 64 Left 2
WINDOW 3 24 0 Left 2
SYMATTR InstName D13
SYMBOL res 5632 1504 R0
WINDOW 3 -18 77 Left 2
SYMATTR Value 10k
SYMATTR InstName R32
SYMBOL npn 5104 1712 R0
SYMATTR InstName Q5
SYMATTR Value 2N3904
SYMBOL cap 4960 1744 R90
WINDOW 0 0 32 VBottom 2
WINDOW 3 32 32 VTop 2
SYMATTR InstName C11
SYMATTR Value 100n
SYMATTR SpiceLine Rser=0.1
SYMBOL res 5056 1744 R0
SYMATTR InstName R33
SYMATTR Value 100k
SYMBOL res 5072 1744 R90
WINDOW 0 0 56 VBottom 2
WINDOW 3 32 56 VTop 2
SYMATTR InstName R17
SYMATTR Value 1k
SYMBOL res -912 1424 R0
SYMATTR InstName R18
SYMATTR Value 1G
SYMBOL res 4848 1472 R90
WINDOW 0 0 56 VBottom 2
WINDOW 3 32 56 VTop 2
SYMATTR InstName R20
SYMATTR Value 1k
SYMBOL voltage 4256 -1216 R180
WINDOW 0 24 96 Left 2
WINDOW 3 24 16 Left 2
SYMATTR InstName V15
SYMATTR Value PULSE(0 5 5.5m 1u 1u 1m 10m)
SYMBOL sw 4544 -1136 R90
SYMATTR InstName S4
SYMATTR Value FAULT_SW
SYMBOL pmos 3936 -336 M270
WINDOW 3 53 65 Left 2
SYMATTR Value HEAVY_PMOS
SYMATTR InstName M3
SYMBOL res 4080 1280 R0
SYMATTR InstName R22
SYMATTR Value 5m
SYMBOL cap 4032 -208 R0
SYMATTR InstName C8
SYMATTR Value 47µ
SYMATTR SpiceLine Rser=0.05
SYMBOL OpAmps\\opamp2 1744 -32 R0
SYMATTR InstName U8
SYMATTR Value tlv3501
SYMBOL voltage 1744 -32 R180
WINDOW 0 24 96 Left 2
WINDOW 3 24 16 Left 2
WINDOW 123 0 0 Left 0
WINDOW 39 0 0 Left 0
SYMATTR InstName V16
SYMATTR Value 5
SYMBOL res 1648 32 R90
WINDOW 0 30 60 VBottom 2
WINDOW 3 32 56 VTop 2
SYMATTR InstName R23
SYMATTR Value 10k
SYMBOL res 1680 272 R180
WINDOW 0 36 76 Left 2
WINDOW 3 36 40 Left 2
SYMATTR InstName R30
SYMATTR Value 3.086k
SYMBOL res 1680 176 R270
WINDOW 0 32 56 VTop 2
WINDOW 3 0 56 VBottom 2
SYMATTR InstName R34
SYMATTR Value 83.3k
SYMBOL voltage 1616 32 R180
WINDOW 0 24 96 Left 2
WINDOW 3 -20 58 Left 2
WINDOW 123 0 0 Left 0
WINDOW 39 0 0 Left 0
SYMATTR InstName V17
SYMATTR Value 2.5
SYMBOL res 5456 -224 R0
SYMATTR InstName R35
SYMATTR Value 1R
SYMBOL res 4864 -304 R0
SYMATTR InstName R36
SYMATTR Value 1
SYMBOL cap 4496 -304 R0
SYMATTR InstName Coss
SYMATTR Value 1.68n
SYMBOL cap 4144 -512 R90
WINDOW 0 0 32 VBottom 2
WINDOW 3 32 32 VTop 2
SYMATTR InstName coss_HS
SYMATTR Value 450p
SYMBOL cap 4224 -160 R0
SYMATTR InstName C12
SYMATTR Value 6.8n
SYMBOL res 4224 -320 R0
SYMATTR InstName R38
SYMATTR Value 2.2
SYMBOL INA181A1 352 928 R0
SYMATTR InstName U11
SYMBOL voltage 208 976 R0
WINDOW 3 -6 62 Left 2
WINDOW 123 0 0 Left 0
WINDOW 39 0 0 Left 0
SYMATTR Value 5
SYMATTR InstName V8
SYMBOL voltage 496 944 R180
WINDOW 0 24 96 Left 2
WINDOW 3 -16 50 Left 2
WINDOW 123 0 0 Left 0
WINDOW 39 0 0 Left 0
SYMATTR InstName V20
SYMATTR Value 2.5
SYMBOL res 720 1056 R90
WINDOW 0 0 56 VBottom 2
WINDOW 3 32 56 VTop 2
SYMATTR InstName R7
SYMATTR Value 100k
SYMBOL res 608 944 R90
WINDOW 0 0 56 VBottom 2
WINDOW 3 32 56 VTop 2
SYMATTR InstName R19
SYMATTR Value 1k
SYMBOL res 688 768 R90
WINDOW 0 0 56 VBottom 2
WINDOW 3 32 56 VTop 2
SYMATTR InstName R21
SYMATTR Value 3.5k
SYMBOL res 544 768 R90
WINDOW 0 0 56 VBottom 2
WINDOW 3 32 56 VTop 2
SYMATTR InstName R39
SYMATTR Value 10k
SYMBOL OpAmps\\opamp2 5936 -896 R0
SYMATTR InstName U12
SYMATTR Value tlv3501
SYMBOL voltage 5728 -832 R180
WINDOW 0 24 96 Left 2
WINDOW 3 24 16 Left 2
WINDOW 123 0 0 Left 0
WINDOW 39 0 0 Left 0
SYMATTR InstName V22
SYMATTR Value 1.65
SYMBOL res 5776 -832 R90
WINDOW 0 25 60 VBottom 2
WINDOW 3 23 63 VTop 2
SYMATTR InstName R44
SYMATTR Value 10k
SYMBOL res 5824 -720 R180
WINDOW 0 2 66 Left 2
WINDOW 3 13 40 Left 2
SYMATTR InstName R45
SYMATTR Value 5.41k
SYMBOL res 6000 -736 R90
WINDOW 0 0 56 VBottom 2
WINDOW 3 32 56 VTop 2
SYMATTR InstName R46
SYMATTR Value 165k
SYMBOL voltage 5936 -848 R180
WINDOW 0 24 96 Left 2
WINDOW 3 24 16 Left 2
WINDOW 123 0 0 Left 0
WINDOW 39 0 0 Left 0
SYMATTR InstName V23
SYMATTR Value 3.3
SYMBOL pmos 640 -1376 R0
SYMATTR InstName M5
SYMATTR Value PFET
SYMBOL diode 224 -1312 R0
SYMATTR InstName D8
SYMATTR Value 1N5819
SYMBOL voltage 240 -1472 R180
WINDOW 0 24 96 Left 2
WINDOW 3 24 16 Left 2
WINDOW 123 0 0 Left 0
WINDOW 39 0 0 Left 0
SYMATTR InstName V_bat1
SYMATTR Value PWL(0 0 1m 22)
SYMBOL voltage 688 -1504 R180
WINDOW 0 24 96 Left 2
WINDOW 3 24 16 Left 2
WINDOW 123 0 0 Left 0
WINDOW 39 0 0 Left 0
SYMATTR InstName V_buck1
SYMATTR Value PWL(0 0 3m 0 5.7m 5)
SYMBOL voltage 432 -1024 R0
WINDOW 0 35 79 Left 2
WINDOW 3 -80 182 Left 2
WINDOW 123 0 0 Left 0
WINDOW 39 0 0 Left 0
SYMATTR InstName V_pgood1
SYMATTR Value PWL(0 0 13.999m 0 14m 3.3)
SYMBOL bv 160 -1376 R90
WINDOW 0 -32 56 VBottom 2
WINDOW 3 32 56 VTop 2
SYMATTR InstName B3
SYMATTR Value V=min(V(vin)-0.5, 4.4)
SYMBOL res 624 -1312 R90
WINDOW 0 0 56 VBottom 2
WINDOW 3 32 56 VTop 2
SYMATTR InstName R41
SYMATTR Value 10k
SYMBOL npn 576 -1072 R0
SYMATTR InstName Q2
SYMATTR Value 2N2222
SYMBOL res 560 -1040 R90
WINDOW 0 0 56 VBottom 2
WINDOW 3 32 56 VTop 2
SYMATTR InstName R42
SYMATTR Value 1k
SYMBOL bv 288 -1120 R90
WINDOW 0 -32 56 VBottom 2
WINDOW 3 32 56 VTop 2
SYMATTR InstName B4
SYMATTR Value V=min(V(v_node)-0.5, 3.3)
SYMBOL res 672 -1520 R0
SYMATTR InstName R43
SYMATTR Value 1
SYMBOL cap 848 -1392 R90
WINDOW 0 0 32 VBottom 2
WINDOW 3 32 32 VTop 2
SYMATTR InstName C13
SYMATTR Value 100µ
TEXT 1144 -320 Left 2 !.model MYSW SW(Ron=0.01 Roff=1Meg Vt=2.5)\n.options trtol=7 reltol=0.01 method=gear
TEXT 1144 -472 Left 2 !.include OPA365.lib
TEXT 1144 -424 Left 2 !.include tlv3501.lib
TEXT 1144 -400 Left 2 !.options gmin=1e-10\n.options ptrantau=0
TEXT 1144 -344 Left 2 ;To overcome the SHDN pin commands in the .lib file we have to include the .options param
TEXT 4104 -800 Left 2 !.model FAULT_SW SW(Ron=10m Roff=1Meg Vt=2.5)
TEXT -664 1128 Left 1 !.model FAULT_NMOS VDMOS(Vto=2.5 Rd=10m)
TEXT 3880 1296 Left 1 !.model SMAJ5_0A D(Is=1n Rs=0.064 Bv=6.4 Ibv=10m Cjo=2000p)
TEXT 5544 1792 Left 2 ;Add button to drain the latch to break the loop to reset the latch without removing the battery
TEXT 4528 1200 Left 2 ;Get a integrated UVLO comparator for this, to prevent random triggering due to brownout situations\nOr put a zener with a 3.3V
TEXT 3720 -912 Left 2 !.model HEAVY_PMOS VDMOS(pchan Rg=2 Rd=5m Rs=2m Vto=-3.0 Kp=60 Cgdmax=3n Cgdmin=1n Cgs=5n Cjo=2n Is=20p mtriode=1 BV=55)
TEXT 4528 1168 Left 2 ;Maybe, give more time delay to this
TEXT 1144 -448 Left 2 !.tran 0 5ms 0 10n startup
TEXT 4104 -864 Left 2 !.model LS_MOS SW(Ron=1.45m Roff=1Meg Vt=2.5 )\n.model HS_MOS SW(Ron=9.2m Roff=1Meg Vt=2.5 )
TEXT -848 1192 Left 3 ;Soft start circuit
TEXT 248 1680 Left 3 ;Hiccuping circuit
TEXT 88 488 Left 3 ;SCP/OCP trigger
TEXT -1168 752 Left 3 ;Type III COmpensator
TEXT -1160 -656 Left 3 ;Oscillator
TEXT 32 328 Left 3 ;PWM Generator
TEXT 1736 2128 Left 3 ;Over temperature Protection
TEXT 3808 1968 Left 3 ;OVP Protection
TEXT -960 1712 Left 3 ;Old SCP/OCP
TEXT 1400 344 Left 2 ;UVLO trigger
TEXT 5400 -424 Left 3 ;Faulty load
TEXT 2752 -408 Left 3 ;PWM masking \nand splitting
TEXT 5144 -960 Left 3 ;Plant
TEXT 4360 -1352 Left 3 ;Over voltage fault switch
TEXT 1144 -504 Left 3 ;Directives
TEXT 1144 -272 Left 2 !.include ina181a1.LIB
TEXT 5504 -1064 Left 2 ;PGOOD (For secondary supply switching)
TEXT -96 -1736 Left 2 ;POWER SUPPLY SWITCHING
TEXT 512 -1224 Left 2 !.model PFET PMOS(Vto=-1.5 Kp=50 W=0.1 L=1u Rd=0.05 Rs=0.01)
RECTANGLE Normal -256 1168 -848 864 2
RECTANGLE Normal 864 1648 240 1264 2
RECTANGLE Normal 0 736 -1168 240 2
RECTANGLE Normal -112 176 -1168 -624 2
RECTANGLE Normal 512 304 32 16 2
RECTANGLE Normal 3408 2096 1728 1424 2
RECTANGLE Normal 6768 1936 3808 864 2
RECTANGLE Normal -400 1664 -960 1264 2
RECTANGLE Normal 2128 320 1360 -176 2
RECTANGLE Normal 5984 16 5392 -384 2
RECTANGLE Normal 3536 160 2752 -352 2
RECTANGLE Normal 5296 -944 3552 80 2
RECTANGLE Normal 4704 -976 3856 -1328 2
RECTANGLE Normal 2160 -256 1136 -480 2
RECTANGLE Normal 1712 1200 80 512 2
RECTANGLE Normal 6320 -640 5504 -1040 2
RECTANGLE Normal 1328 -720 -96 -1680 2

The netlist it stands for:
* behavioural_model_complete.asc
C1 Vout 0 27.77µ V=25 Rser=2.94m Lser=0.6n
L1 switch_node Vout 5.6µ Rser=1m
V1 N037 0 2.5
Rf1 Vout N029 7.91k
Rf3 N031 N029 50
Cf3 Vout N031 10n
Rc1 N030 N029 2.99k
Cc2 comp_out N029 237p
Rf2 N029 0 7.91k
V2 P001 0 5
Cc1 comp_out N030 26.6n
C2 Vout 0 27.77µ V=25 Rser=2.94m Lser=0.6n
C3 Vout 0 27.77µ V=25 Rser=2.94m Lser=0.6n
X§U1 comp_out V_trig N028 0 PWM_signal tlv3501  ; pins In+ In- V+ V- OUT
V3 N028 0 5
S1 switch_node N013 N014 0 HS_MOS
V4 Battery_in 0 22
V5 P002 0 5
V6 N015 0 5
R1 V_trig N023 8k
R2 N023 V_comp 10k
R3 N012 V_comp 6.944k
C4 V_trig N012 100p
Vref_comp1 N022 0 2.5
Vref_int1 N016 0 2.5
X§U2 N016 N012 N015 0 V_trig OPA365  ; pins In+ In- V+ V- OUT
X§U3 N023 N022 P002 0 V_comp tlv3501  ; pins In+ In- V+ V- OUT
X§U4 N032 N029 P001 0 comp_out OPA365  ; pins In+ In- V+ V- OUT
R4 N032 N037 10k
C5 N032 0 50n
D2 N032 N037 1N5817
S2 V_sense switch_node N018 0 LS_MOS
D1 V_sense switch_node BAT54
D3 comp_out N029 D
R5 AND_IN N045 4000
C6 AND_IN 0 100p
D4 AND_IN N045 BAT54
R6 V_sense 0 10m
X§U5 N043 N034 N035 0 N039 tlv3501  ; pins In+ In- V+ V- OUT
A2 N039 0 PWM_signal 0 0 N036 N040 0 DFLOP Vhigh=5 Vlow=0 Ref=2.5 Trise=5n Tfall=5n Td=0n
A3 0 N033 N036 0 0 0 0 0 AND Vhigh=5 Vlow=0 Ref=2.5 Trise=5n Tfall=5n
V7 N035 0 5
S3 N025 P003 N020 0 FAULT_SW
R§0.3 N017 P003 0.5
V9 N020 0 PULSE(0 5 2.5m 1u 1u 0.5m 10m)
M1 N032 N055 N044 N044 FAULT_NMOS
R8 N044 0 1k
C7 N051 0 10n
R9 N051 0 100k
D5 N040 N048 D
R10 N048 N051 10k
X§U6 N051 N054 P004 0 N055 tlv3501  ; pins In+ In- V+ V- OUT
V10 P004 0 5
V11 N054 0 2.5
A4 0 0 0 0 0 0 N033 0 BUF Vhigh=5 Vlow=0 Ref=2.5 Td=0n Trise=5n Tfall=5n
A1 PWM_signal 0 0 0 0 0 N019 0 BUF Vhigh=5 Vlow=0 Ref=2.5 Td=50n
A5 0 N019 PWM_signal 0 0 0 N014 0 AND Vhigh=5 Vlow=0 Ref=2.5 Trise=5n Tfall=5n
A6 N019 0 PWM_signal 0 0 N018 0 0 OR Vhigh=5 Vlow=0 Vt=2.5 Trise=5n Tfall=5n
M2 Battery_in PMOS_gate PMOS_source PMOS_source HEAVY_PMOS
R11 PMOS_gate 0 100k
D6 PMOS_gate PMOS_source BZX84C12L
R12 N057 N062 R=10k * exp(3950 * (1/(V(T_node)+273.15) - 1/298.15))
R13 N062 0 10k
V12 N057 0 5
X§U7 N063 N062 N059 0 OTP_out tlv3501  ; pins In+ In- V+ V- OUT
V13 N059 0 5
R14 N063 N057 10k
R15 0 N063 136.1k
R16 OTP_out N063 186.8k
V14 0 0 PWL(0 25 3.5m 25 4m 125 4.5m 25 7m 25)
X§U9 V_v+ N050 N049 0 V_OVP_comp tlv3501  ; pins In+ In- V+ V- OUT
V18 N049 0 PWL(0 0 1m 5 6m 5 6.001m 0 7m 0)
V19 N050 0 2.5
Q3 N046 npn_base 0 0 2N3904
Q4 N058 N047 PMOS_source 0 2N3906
R24 N047 N046 4.7k
R25 npn_base N053 4.7k
D10 N052 N053 BAT54
R26 N056 N058 4.7k
D11 N058 PMOS_gate 1N5819
R27 PMOS_source N047 10k
D12 P005 Vout SMAJ5_0A
R28 V_v+ Vout 12K
R29 V_v+ 0 10K
C9 V_v+ 0 1n
C10 npn_base 0 10n
R31 PMOS_source N046 10k
D13 N056 npn_base D
R32 npn_base 0 10k
Q5 N052 N061 0 0 2N3904
C11 N060 N049 100n Rser=0.1
R33 N061 0 100k
R17 N061 N060 1k
R18 N045 0 1G
R20 N052 V_OVP_comp 1k
V15 N005 0 PULSE(0 5 5.5m 1u 1u 1m 10m)
S4 N007 N006 N005 0 FAULT_SW
M3 N013 PMOS_gate PMOS_source PMOS_source HEAVY_PMOS
R22 0 P005 5m
C8 N013 0 47µ Rser=0.05
X§U8 N027 N026 N024 0 UVLO_out tlv3501  ; pins In+ In- V+ V- OUT
V16 N024 0 5
R23 N027 Battery_in 10k
R30 0 N027 3.086k
R34 N027 UVLO_out 83.3k
V17 N026 0 2.5
R35 N017 N025 1R
R36 Vout 0 1
Coss switch_node V_sense 1.68n
coss_HS switch_node N013 450p
C12 N021 0 6.8n
R38 switch_node N021 2.2
X§U11 0 V_sense N041 0 N038 N042 INA181A1  ; pins INP INN VCC GND REF OUT
V8 N041 0 5
V20 N038 0 2.5
R7 N039 N043 100k
R19 N043 N042 1k
R21 N035 N034 3.5k
R39 N034 0 10k
X§U12 N011 N010 P006 0 PGOOD_comp tlv3501  ; pins In+ In- V+ V- OUT
V22 N010 0 1.65
R44 N011 Vout 10k
R45 0 N011 5.41k
R46 PGOOD_comp N011 165k
V23 P006 0 3.3
M5 N003 N004 v_node v_node PFET
D8 N002 v_node 1N5819
V_bat1 vin 0 PWL(0 0 1m 22)
V_buck1 N001 0 PWL(0 0 3m 0 5.7m 5)
V_pgood1 N008 0 PWL(0 0 13.999m 0 14m 3.3)
B3 N002 0 V=min(V(vin)-0.5, 4.4)
R41 N004 v_node 10k
Q2 N004 N009 0 0 2N2222
R42 N009 N008 1k
B4 v_out 0 V=min(V(v_node)-0.5, 3.3)
R43 N001 N003 1
C13 0 N003 100µ
.model D D
.lib standard.dio
.model NPN NPN
.model PNP PNP
.lib standard.bjt
.model NMOS NMOS
.model PMOS PMOS
.lib standard.mos
.model MYSW SW(Ron=0.01 Roff=1Meg Vt=2.5)
.options trtol=7 reltol=0.01 method=gear
.include OPA365.lib
.include tlv3501.lib
.options gmin=1e-10
.options ptrantau=0
* To overcome the SHDN pin commands in the .lib file we have to include the .options param
.model FAULT_SW SW(Ron=10m Roff=1Meg Vt=2.5)
.model FAULT_NMOS VDMOS(Vto=2.5 Rd=10m)
.model SMAJ5_0A D(Is=1n Rs=0.064 Bv=6.4 Ibv=10m Cjo=2000p)
* Add button to drain the latch to break the loop to reset the latch without removing the battery
* Get a integrated UVLO comparator for this, to prevent random triggering due to brownout situations
* Or put a zener with a 3.3V
.model HEAVY_PMOS VDMOS(pchan Rg=2 Rd=5m Rs=2m Vto=-3.0 Kp=60 Cgdmax=3n Cgdmin=1n Cgs=5n Cjo=2n Is=20p mtriode=1 BV=55)
* Maybe, give more time delay to this
.tran 0 5ms 0 10n startup
.model LS_MOS SW(Ron=1.45m Roff=1Meg Vt=2.5 )
.model HS_MOS SW(Ron=9.2m Roff=1Meg Vt=2.5 )
* Soft start circuit
* Hiccuping circuit
* SCP/OCP trigger
* Type III COmpensator
* Oscillator
* PWM Generator
* Over temperature Protection
* OVP Protection
* Old SCP/OCP
* UVLO trigger
* Faulty load
* PWM masking
* and splitting
* Plant
* Over voltage fault switch
* Directives
.include ina181a1.LIB
* PGOOD (For secondary supply switching)
* POWER SUPPLY SWITCHING
.model PFET PMOS(Vto=-1.5 Kp=50 W=0.1 L=1u Rd=0.05 Rs=0.01)
.lib ina181a1.lib
.backanno
.end